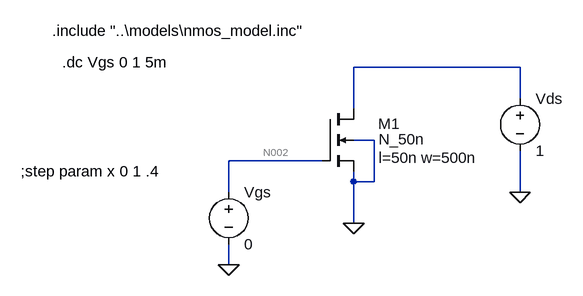
[diagram p0: schematic nmos_Id_Vgs.asc]
nmos_Id_Vgs.asc, the LTspice schematic file:
Version 4.1
SHEET 1 880 680
WIRE 496 64 240 64
WIRE 496 112 496 64
WIRE 240 128 240 64
WIRE 272 176 240 176
WIRE 192 208 48 208
WIRE 240 240 240 224
WIRE 272 240 272 176
WIRE 272 240 240 240
WIRE 48 256 48 208
WIRE 496 256 496 192
WIRE 240 304 240 240
WIRE 48 368 48 336
FLAG 48 368 0
FLAG 240 304 0
FLAG 496 256 0
SYMBOL nmos4 192 128 R0
WINDOW 0 86 23 Left 2
WINDOW 3 87 47 Left 2
WINDOW 123 87 75 Left 2
SYMATTR InstName M1
SYMATTR Value N_50n
SYMATTR Value2 l=50n w=500n
SYMBOL voltage 48 240 R0
SYMATTR InstName Vgs
SYMATTR Value 0
SYMBOL voltage 496 96 R0
SYMATTR InstName Vds
SYMATTR Value 1
TEXT -224 8 Left 2 !.include "..\\models\\nmos_model.inc"
TEXT -208 56 Left 2 !.dc Vgs 0 1 5m
TEXT -272 224 Left 2 !;step param x 0 1 .4

The netlist it stands for:
* nmos_Id_Vgs.asc
M1 N001 N002 0 0 N_50n l=50n w=500n
Vgs N002 0 0
Vds N001 0 1
.model NMOS NMOS
.model PMOS PMOS
.lib standard.mos
.include "..\models\nmos_model.inc"
.dc Vgs 0 1 5m
;step param x 0 1 .4
.backanno
.end

* Results of the author's LTspice run, read from the files saved beside the schematic
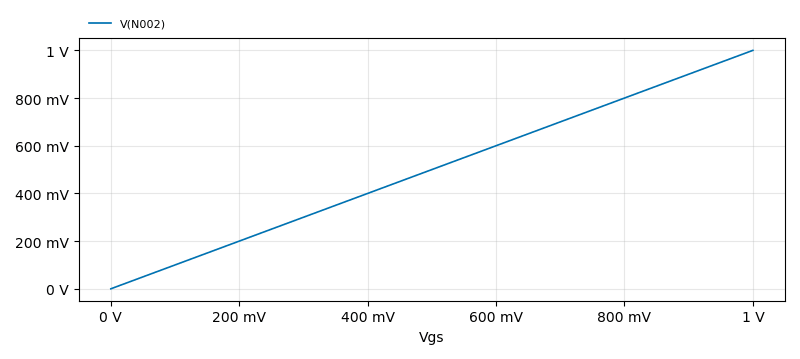
[diagram p1: DC transfer characteristic of nmos_Id_Vgs.asc, plotted from the saved traces]
* DC transfer characteristic, 1 run:
*   V(N002): 0 V at Vgs=0 V, 1 V at Vgs=1 V, min 0 V, max 1 V